# Altium schematic sheet Stamp.SchDoc: BattleShips
size A4; ApprovedBy: Szczepan Kozdęba; CheckedBy: Szczepan Kozdęba; Author: Szczepan Kozdęba; CompanyName: AGH; DrawnBy: Szczepan Kozdęba; Engineer: Szczepan Kozdęba; Organization: AGH; Address1: Chocimska; Address2: 30 - 057; Address4: Poland; Revision: Rev 0; SheetNumber: 1; SheetTotal: 1
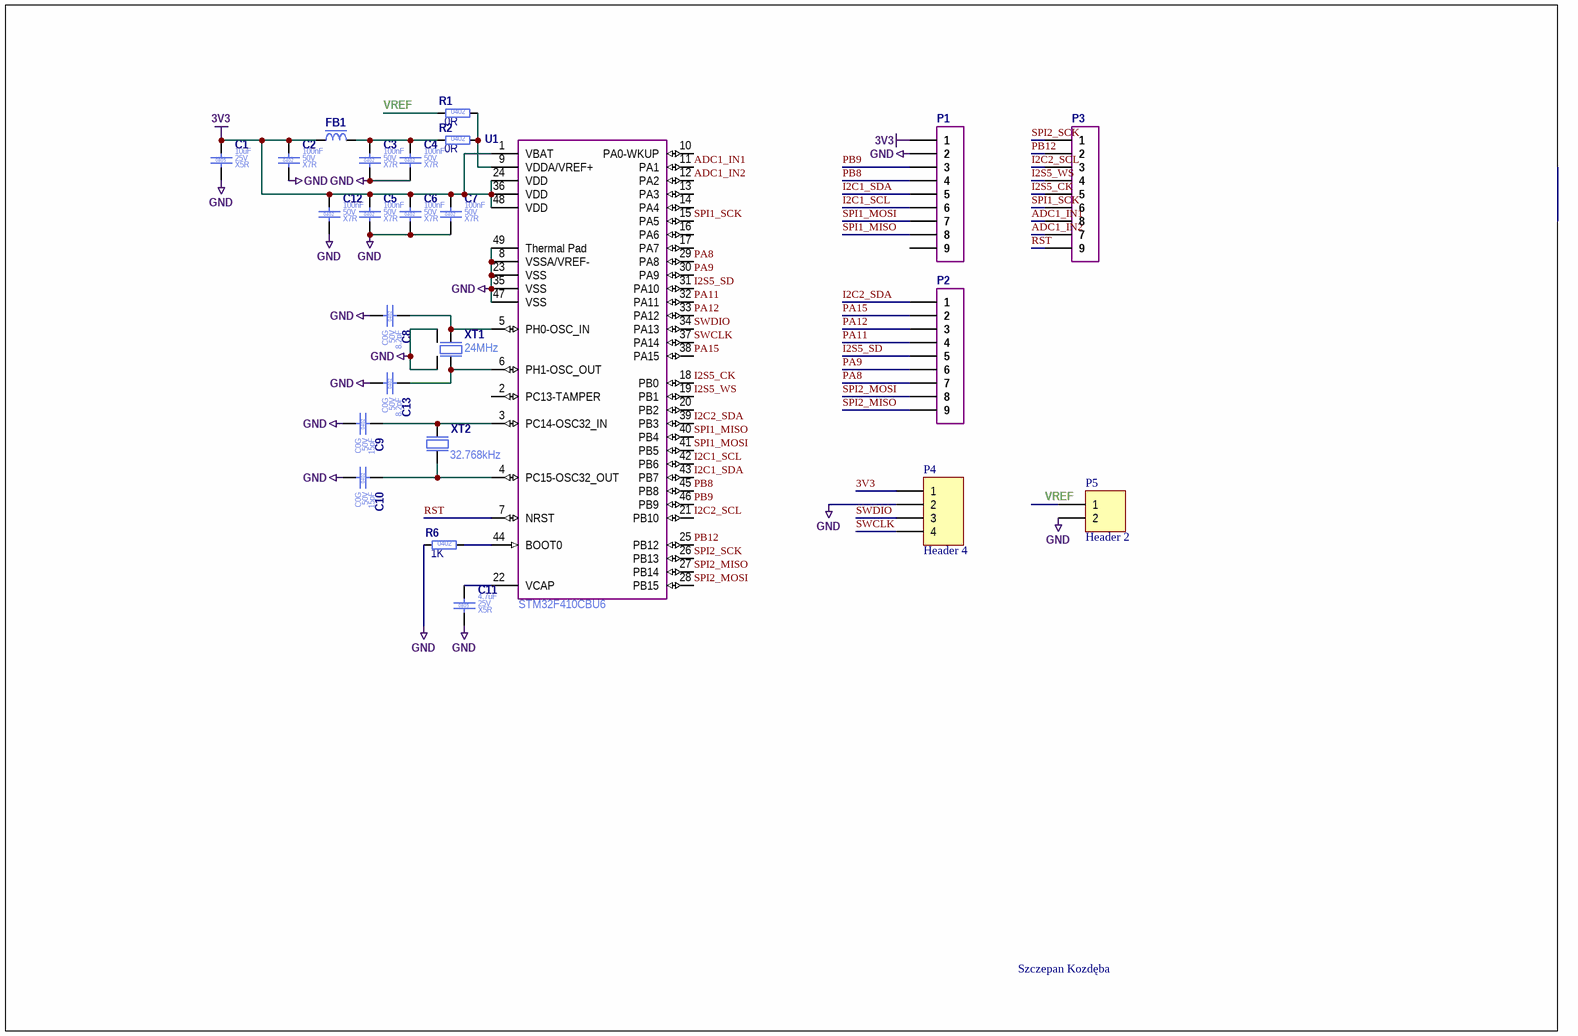
[diagram p0: Stamp.SchDoc]

## Parts
C1  Case/Package: 0805  Voltage Rating (DC): 25V  Dielectric: X5R  Capacitance: 10uF  [C_0805_2012]  (hidden comment: C_10UF_25V_X5R_0805_10)
C2  Case/Package: 0402  Voltage Rating (DC): 50V  Dielectric: X7R  Capacitance: 100nF  [C_0402_1005]  (hidden comment: C_100NF_50V_X7R_0402_10)
C3  Case/Package: 0402  Voltage Rating (DC): 50V  Dielectric: X7R  Capacitance: 100nF  [C_0402_1005]  (hidden comment: C_100NF_50V_X7R_0402_10)
C4  Case/Package: 0402  Voltage Rating (DC): 50V  Dielectric: X7R  Capacitance: 100nF  [C_0402_1005]  (hidden comment: C_100NF_50V_X7R_0402_10)
C5  Case/Package: 0402  Voltage Rating (DC): 50V  Dielectric: X7R  Capacitance: 100nF  [C_0402_1005]  (hidden comment: C_100NF_50V_X7R_0402_10)
C6  Case/Package: 0402  Voltage Rating (DC): 50V  Dielectric: X7R  Capacitance: 100nF  [C_0402_1005]  (hidden comment: C_100NF_50V_X7R_0402_10)
C7  Case/Package: 0402  Voltage Rating (DC): 50V  Dielectric: X7R  Capacitance: 100nF  [C_0402_1005]  (hidden comment: C_100NF_50V_X7R_0402_10)
C8  Case/Package: 0402  Voltage Rating (DC): 50V  Dielectric: C0G  Capacitance: 8.2pF  [C_0402_1005]  (hidden comment: C_8P2F_50V_C0G_0402_3)
C9  Case/Package: 0402  Voltage Rating (DC): 50V  Dielectric: C0G  Capacitance: 15pF  [C_0402_1005]  (hidden comment: C_15PF_50V_C0G_0402_5)
C10  Case/Package: 0402  Voltage Rating (DC): 50V  Dielectric: C0G  Capacitance: 15pF  [C_0402_1005]  (hidden comment: C_15PF_50V_C0G_0402_5)
C11  Case/Package: 0805  Voltage Rating (DC): 25V  Dielectric: X5R  Capacitance: 4.7uF  [C_0805_2012]  (hidden comment: C_10UF_25V_X5R_0805_10)
C12  Case/Package: 0402  Voltage Rating (DC): 50V  Dielectric: X7R  Capacitance: 100nF  [C_0402_1005]  (hidden comment: C_100NF_50V_X7R_0402_10)
C13  Case/Package: 0402  Voltage Rating (DC): 50V  Dielectric: C0G  Capacitance: 8.2pF  [C_0402_1005]  (hidden comment: C_8P2F_50V_C0G_0402_3)
FB1  MLZ2012M2R2HT000  [FB_0805_2012]  (value not drawn)
P1  826629-9  [HEADER_M_1x9_2.54]  (value not drawn)
P2  826629-9  [HEADER_M_1x9_2.54]  (value not drawn)
P3  826629-9  [HEADER_M_1x9_2.54]  (value not drawn)
P4  Header 4  [HDR1X4]
P5  Header 2  [HDR1X2]
R1  Resistance: 0R  Case/Package: 0402  [R_0402_1005]  (hidden comment: R_0R_0402_1)
R2  Resistance: 0R  Case/Package: 0402  [R_0402_1005]  (hidden comment: R_0R_0402_1)
R6  Resistance: 1K  Case/Package: 0402  [R_0402_1005]  (hidden comment: R_1K_0402_1)
U1  STM32F410CBU6  [QFN50P700X700X100_HS-49N]
XT1  Frequency: 24MHz  [X_3.2x2.5]  (hidden comment: TSX-3225 24.0000MF20G-AC)
XT2  Frequency: 32.768kHz  [ABS10_4.9X1.8]  (hidden comment: ABS10-32.768KHZ-1-T)

## Nets
3V3: C1.1 C2.1 C5.1 C6.1 C7.1 C12.1 FB1.1 P1.1 P4.1 U1.1(VBAT) U1.24(VDD) U1.36(VDD) U1.48(VDD)
GND: C1.2 C2.2 C3.2 C4.2 C5.2 C6.2 C7.2 C8.2 C9.2 C10.2 C11.2 C12.2 C13.2 P1.2 P4.2 P5.2 R6.1 U1.8(VSSA/VREF-) U1.23(VSS) U1.35(VSS) U1.47(VSS) U1.49(Thermal_Pad) XT1.2(GND) XT1.4(GND)
ADC1_IN1: P3.8 U1.11(PA1)
ADC1_IN2: P3.7 U1.12(PA2)
I2C1_SCL: P1.6 U1.42(PB6)
I2C1_SDA: P1.5 U1.43(PB7)
I2C2_SCL: P3.3 U1.21(PB10)
I2C2_SDA: P2.1 U1.39(PB3)
I2S5_CK: P3.5 U1.18(PB0)
I2S5_SD: P2.5 U1.31(PA10)
I2S5_WS: P3.4 U1.19(PB1)
PA8: P2.7 U1.29(PA8)
PA9: P2.6 U1.30(PA9)
PA11: P2.4 U1.32(PA11)
PA12: P2.3 U1.33(PA12)
PA15: P2.2 U1.38(PA15)
PB8: P1.4 U1.45(PB8)
PB9: P1.3 U1.46(PB9)
PB12: P3.2 U1.25(PB12)
RST: P3.9 U1.7(NRST)
SPI1_MISO: P1.8 U1.40(PB4)
SPI1_MOSI: P1.7 U1.41(PB5)
SPI1_SCK: P3.6 U1.15(PA5)
SPI2_MISO: P2.9 U1.27(PB14)
SPI2_MOSI: P2.8 U1.28(PB15)
SPI2_SCK: P3.1 U1.26(PB13)
SWCLK: P4.4 U1.37(PA14)
SWDIO: P4.3 U1.34(PA13)
VREF: P5.1 R1.1
NetC3_1: C3.1 C4.1 FB1.2 R2.1
NetC8_1: C8.1 U1.5(PH0-OSC_IN) XT1.1(IN)
NetC9_1: C9.1 U1.3(PC14-OSC32_IN) XT2.2(out)
NetC10_1: C10.1 U1.4(PC15-OSC32_OUT) XT2.1(inp)
NetC11_1: C11.1 U1.22(VCAP)
NetC13_1: C13.1 U1.6(PH1-OSC_OUT) XT1.3(OUT)
NetR1_2: R1.2 R2.2 U1.9(VDDA/VREF+)
NetR6_2: R6.2 U1.44(BOOT0)

Not connected (* = marked no-connect by the designer): P1 9; U1 2(PC13-TAMPER) 10(PA0-WKUP) 13(PA3) 14(PA4) 16(PA6) 17(PA7) 20(PB2)

## Notes on the sheet
- Szczepan Kozdęba
- Title
- Size:
- Date:
- A4

## Library data of the parts
C1 = C_10UF_25V_X5R_0805_10: Ceramic Capacitor; Manufacturer Part Number: CL21A106KAYNNNE; Manufacturer: Samsung Electro-Mechanics; Value: 10uF; Tolerance: 10%; Part Number: C_10UF_25V_X5R_0805_10; Mount: Surface Mount; Height: 1.35mm; HelpURL: https://pl.mouser.com/datasheet/2/585/MLCC-1837944.pdf; RoHS: Compliant; Max Operating Temperature: 85°C; Status: MK; Supplier 1: Mouser; Supplier Part Number 1: 187-CL21A106KAYNNNE; Supplier 2: LCSC; Supplier Part Number 2: C15850; Manufacturer 2: Samsung Electro-Mechanics; Manufacturer Part Number 2: CL21A106KAYNNNE
C2-C7 C12 = C_100NF_50V_X7R_0402_10: Ceramic Capacitor; Manufacturer Part Number: C1005X7R1H104K050BB; Manufacturer: TDK; Value: 100nF; Tolerance: 10%; Part Number: C_100NF_50V_X7R_0402_10; Mount: Surface Mount; Height: 500um; HelpURL: https://product.tdk.com/info/en/catalog/datasheets/mlcc_commercial_general_en.pdf?ref_disty=mouser; RoHS: Compliant; Max Operating Temperature: 125°C; Status: MK; Supplier 1: Mouser; Supplier Part Number 1: 810-C1005X7R1H104K
C8 C13 = C_8P2F_50V_C0G_0402_3: Ceramic Capacitor; Manufacturer Part Number: UMK105CG8R2DV-F; Manufacturer: Taiyo Yuden; Value: 8.2pF; Tolerance: 3%; Part Number: C_8P2F_50V_C0G_0402_3; Mount: Surface Mount; Height: 500um; HelpURL: https://pl.mouser.com/datasheet/2/396/mlcc02_e-1307760.pdf; RoHS: Compliant; Max Operating Temperature: 125°C; Status: MK; Supplier 1: Mouser; Supplier Part Number 1: 963-UMK105CG8R2DV-F
C9 C10 = C_15PF_50V_C0G_0402_5: Ceramic Capacitor; Manufacturer Part Number: CC0402JRNPO9BN150; Manufacturer: Yageo; Value: 15pF; Tolerance: 5%; Part Number: C_15PF_50V_C0G_0402_5; Mount: Surface Mount; Height: 500um; HelpURL: http://datasheet.octopart.com/CC0402JRNPO9BN150-Yageo-datasheet-10406438.pdf; RoHS: Compliant; Max Operating Temperature: 125°C; Supplier 1: Mouser; Supplier Part Number 1: 603-CC402JRNPO9BN150
C11 = C_10UF_25V_X5R_0805_10: Ceramic Capacitor; Manufacturer Part Number: CL21A106KAYNNNE; Manufacturer: Samsung Electro-Mechanics; Value: 4.7uF; Tolerance: 10%; Part Number: C_10UF_25V_X5R_0805_10; Mount: Surface Mount; Height: 1.35mm; HelpURL: https://pl.mouser.com/datasheet/2/585/MLCC-1837944.pdf; RoHS: Compliant; Max Operating Temperature: 85°C; Status: MK; Supplier 1: Mouser; Supplier Part Number 1: 187-CL21A106KAYNNNE; Supplier 2: LCSC; Supplier Part Number 2: C15850; Manufacturer 2: Samsung Electro-Mechanics; Manufacturer Part Number 2: CL21A106KAYNNNE
FB1 = MLZ2012M2R2HT000: Ferrite Bead; Manufacturer: TDK; Max Current Rating: 600mA; Frequency: 2MHz; Impedance: 30; Tolerance: 20; DC Resistance (DCR): 208m; Box: 412; Part Number: MLZ2012M2R2HT000; Case/Package: 0805; Manufacturer Part Number: MLZ2012M2R2HT000; Height: 1.45mm; Mount: Surface Mount; Max Operating Temperature: 125°C; HelpURL: https://product.tdk.com/info/en/catalog/datasheets/inductor_commercial_decoupling_mlz2012_en.pdf?ref_disty=mouser; RoHS: Compliant; Status: MK; Supplier 1: Mouser; Supplier Part Number 1: 810-MLZ2012M2R2HT000; Stock: 15
P1-P3 = 826629-9: Header, 9-Pin; Manufacturer: TE Connectivity; Gender: Male; Pitch: 2.54mm; Part Number: 826629-9; Manufacturer Part Number: 826629-9; Mount: Through Hole; Number of Rows: 1; Orientation: Straight; HelpURL: http://sigma.octopart.com/12110114/technical_drawing/TE-Connectivity-826629-9.pdf; Max Operating Temperature: 0°C; Number of Pins: 9
P4 = Header 4: Header, 4-Pin; LatestRevisionDate: 17-Jul-2002; LatestRevisionNote: Re-released for DXP Platform.; Publisher: Altium Limited
P5 = Header 2: Header, 2-Pin; LatestRevisionDate: 17-Jul-2002; LatestRevisionNote: Re-released for DXP Platform.; Publisher: Altium Limited
R1 R2 = R_0R_0402_1: Thick Film Resistor; Manufacturer: Yageo; Manufacturer Part Number: RC0402FR-070RL; Value: 0R; Tolerance: 1%; Voltage Rating (DC): 50V; Power Rating: 63mW; Stats: MK; Part Number: R_0R_0402_1; Mount: Surface Mount; Height: 350um; HelpURL: http://datasheet.octopart.com/2176049-1-TE-Connectivity---AMP-datasheet-11120217.pdf; RoHS: Compliant; Max Operating Temperature: 155°C; Supplier 1: Mouser; Supplier Part Number 1: 603-RC0402FR-070RL; Manufacturer 2: Uniroyal Elec; Manufacturer Part Number 2: 0402WGF0000TCE; Supplier 2: LCSC; Supplier Part Number 2: C17168
R6 = R_1K_0402_1: Thick Film Resistor; Manufacturer: Yageo; Manufacturer Part Number: RC0402FR-7D1KL; Value: 1K; Tolerance: 1%; Voltage Rating (DC): 50V; Power Rating: 63mW; Stats: MK; Part Number: R_1K_0402_1; Mount: Surface Mount; Height: 350um; HelpURL: https://pl.mouser.com/datasheet/2/447/PYu-RC_Group_51_RoHS_L_10-1664068.pdf; RoHS: Compliant; Max Operating Temperature: 155°C; Supplier 1: Mouser; Supplier Part Number 1: 603-RC0402FR-7D1KL; Manufacturer 2: Uniroyal Elec; Manufacturer Part Number 2: 0402WGF1001TCE; Supplier 2: LCSC; Supplier Part Number 2: C11702
U1 = STM32F410CBU6: IC MCU 32BIT 128KB FLASH 48QFPN; Manufacturer: STMicroelectronics; Core Architecture: ARM; Max Frequency: 100MHz; Min Supply Voltage: 1.7V; Max Supply Voltage: 3.6V; RAM Size: 32kB; Box: 330; Manufacturer Part Number: STM32F410CBU6; Part Number: STM32F410CBU6; Mount: Surface Mount; Case/Package: UFQFPN; Height: 0.55; HelpURL: https://pl.mouser.com/datasheet/2/389/stm32f410cb-956320.pdf; Memory Size: 128kB; Memory Type: FLASH; Max Operating Temperature: 85°C; Number of Pins: 48; RoHS: Compliant; Status: MK; Supplier 1: Mouser; Supplier Part Number 1: 511-STM32F410CBU6; Stock: 2
XT1 = TSX-3225 24.0000MF20G-AC: Resonator Ceramic; Manufacturer: Epson; Manufacturer Part Number: TSX-3225 24.0000MF20G-AC0; Frequency Tolerance: 10ppm; Box: 236; Part Number: TSX-3225 24.0000MF20G-AC; Mount: Surface Mount; Height: 0.6mm; HelpURL: https://pl.mouser.com/datasheet/2/137/FA_238_en-932914.pdf; Max Operating Temperature: 75C; Number of Pins: 4; RoHS: Compliant; Supplier 1: Mouser; Supplier Part Number 1: 732-322524F20GAC0; Stock: 21
XT2 = ABS10-32.768KHZ-1-T: Crystal; Manufacturer: Abracon; Frequency Tolerance: 10ppm; Box: 375; Part Number: ABS10-32.768KHZ-1-T; Mount: Surface Mount; Height: 1mm; HelpURL: https://pl.mouser.com/datasheet/2/3/ABS10-17136.pdf; Max Operating Temperature: 85; Number of Pins: 2; RoHS: Compliant; Manufacturer Part Number: ABS10-32.768KHZ-1-T; Supplier 1: Mouser; Supplier Part Number 1: 815-ABS10-32.7K-1-T; Stock: 28